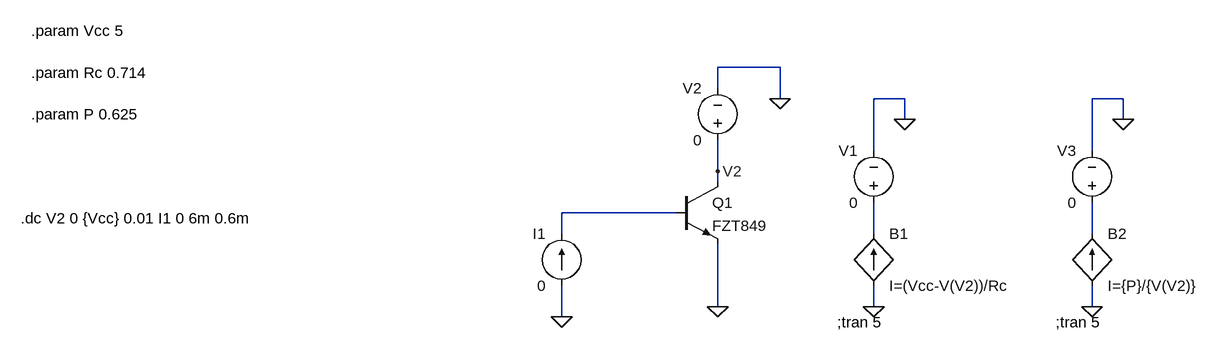
[diagram p0: schematic VT_load line.asc]
VT_load line.asc, the LTspice schematic file:
Version 4
SHEET 1 880 680
WIRE 64 -48 -32 -48
WIRE -32 -16 -32 -48
WIRE 64 0 64 -48
WIRE 256 0 208 0
WIRE 592 0 544 0
WIRE 256 32 256 0
WIRE 592 32 592 0
WIRE 208 80 208 0
WIRE 544 80 544 0
WIRE -32 112 -32 64
WIRE -32 128 -32 112
WIRE -96 176 -272 176
WIRE -272 208 -272 176
WIRE 208 208 208 160
WIRE 544 208 544 160
WIRE -32 320 -32 224
WIRE 208 320 208 288
WIRE 544 320 544 288
WIRE -272 336 -272 288
FLAG 256 32 0
FLAG 208 320 0
FLAG -32 320 0
FLAG 64 0 0
FLAG -272 336 0
FLAG -32 112 V2
FLAG 592 32 0
FLAG 544 320 0
SYMBOL bi2 208 208 R0
SYMATTR InstName B1
SYMATTR Value I=(Vcc-V(V2))/Rc
SYMBOL voltage 208 176 R180
WINDOW 0 24 96 Left 2
WINDOW 3 24 16 Left 2
SYMATTR InstName V1
SYMATTR Value 0
SYMBOL npn -96 128 R0
SYMATTR InstName Q1
SYMATTR Value FZT849
SYMBOL voltage -32 80 R180
WINDOW 0 24 96 Left 2
WINDOW 3 24 16 Left 2
SYMATTR InstName V2
SYMATTR Value 0
SYMBOL current -272 288 R180
WINDOW 0 24 80 Left 2
WINDOW 3 24 0 Left 2
SYMATTR InstName I1
SYMATTR Value 0
SYMBOL bi2 544 208 R0
SYMATTR InstName B2
SYMATTR Value I={P}/{V(V2)}
SYMBOL voltage 544 176 R180
WINDOW 0 24 96 Left 2
WINDOW 3 24 16 Left 2
SYMATTR InstName V3
SYMATTR Value 0
TEXT 152 344 Left 2 !;tran 5
TEXT -1088 -104 Left 2 !.param Vcc 5
TEXT -1088 -40 Left 2 !.param Rc 0.714
TEXT -1104 184 Left 2 !.dc V2 0 {Vcc} 0.01 I1 0 6m 0.6m
TEXT 488 344 Left 2 !;tran 5
TEXT -1088 24 Left 2 !.param P 0.625

The netlist it stands for:
* VT_load line.asc
B1 0 N002 I=(Vcc-V(V2))/Rc
V1 N002 0 0
Q1 V2 N001 0 0 FZT849
V2 V2 0 0
I1 0 N001 0
B2 0 N003 I={P}/{V(V2)}
V3 N003 0 0
.model NPN NPN
.model PNP PNP
.lib standard.bjt
;tran 5
.param Vcc 5
.param Rc 0.714
.dc V2 0 {Vcc} 0.01 I1 0 6m 0.6m
;tran 5
.param P 0.625
.backanno
.end

* Results of the author's LTspice run, read from the files saved beside the schematic
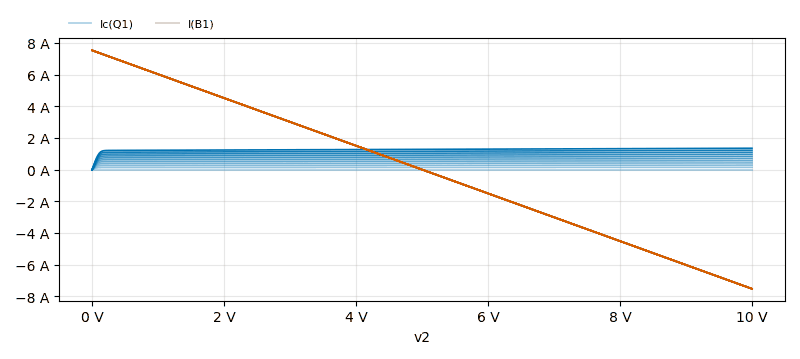
[diagram p1: DC transfer characteristic of VT_load line.asc, plotted from the saved traces]
* DC transfer characteristic, 11 runs:
*   Ic(Q1) [i1=0]: 1.716e-15 fA at v2=0 V, 167.3 pA at v2=10 V, min 1.716e-15 fA, max 167.3 pA
*   Ic(Q1) [i1=0.0006]: -1.766 mA at v2=0 V, 141.1 mA at v2=10 V, min -1.766 mA, max 141.1 mA
*   Ic(Q1) [i1=0.0012]: -3.404 mA at v2=0 V, 281.9 mA at v2=10 V, min -3.404 mA, max 281.9 mA
*   Ic(Q1) [i1=0.0018]: -4.885 mA at v2=0 V, 421 mA at v2=10 V, min -4.885 mA, max 421 mA
*   Ic(Q1) [i1=0.0024]: -6.231 mA at v2=0 V, 558.4 mA at v2=10 V, min -6.231 mA, max 558.4 mA
*   Ic(Q1) [i1=0.003]: -7.464 mA at v2=0 V, 694.1 mA at v2=10 V, min -7.464 mA, max 694.1 mA
*   Ic(Q1) [i1=0.0036]: -8.601 mA at v2=0 V, 828.1 mA at v2=10 V, min -8.601 mA, max 828.1 mA
*   Ic(Q1) [i1=0.0042]: -9.658 mA at v2=0 V, 960.4 mA at v2=10 V, min -9.658 mA, max 960.4 mA
*   I(B1) [i1=0]: 7.53 A at v2=0 V, -7.53 A at v2=10 V, min -7.53 A, max 7.53 A
*   I(B1) [i1=0.0006]: 7.53 A at v2=0 V, -7.53 A at v2=10 V, min -7.53 A, max 7.53 A
*   I(B1) [i1=0.0012]: 7.53 A at v2=0 V, -7.53 A at v2=10 V, min -7.53 A, max 7.53 A
*   I(B1) [i1=0.0018]: 7.53 A at v2=0 V, -7.53 A at v2=10 V, min -7.53 A, max 7.53 A
*   I(B1) [i1=0.0024]: 7.53 A at v2=0 V, -7.53 A at v2=10 V, min -7.53 A, max 7.53 A
*   I(B1) [i1=0.003]: 7.53 A at v2=0 V, -7.53 A at v2=10 V, min -7.53 A, max 7.53 A
*   I(B1) [i1=0.0036]: 7.53 A at v2=0 V, -7.53 A at v2=10 V, min -7.53 A, max 7.53 A
*   I(B1) [i1=0.0042]: 7.53 A at v2=0 V, -7.53 A at v2=10 V, min -7.53 A, max 7.53 A